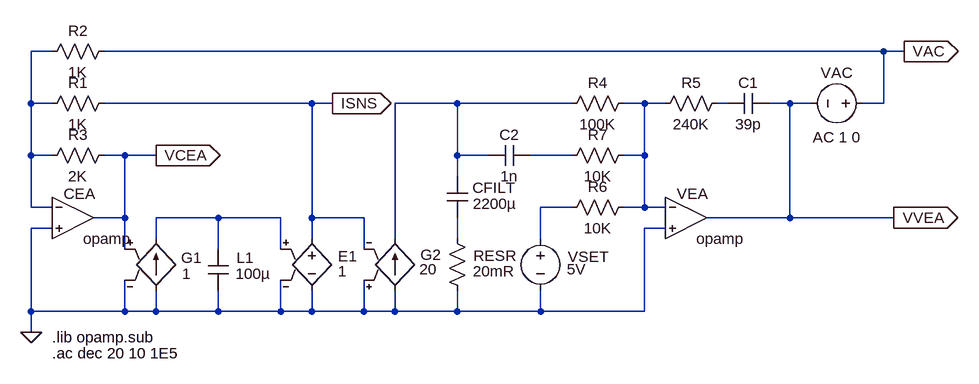
[diagram p0: schematic vimodlinc.asc]
vimodlinc.asc, the LTspice schematic file:
Version 4
SHEET 1 880 680
WIRE -816 128 -816 48
WIRE -816 208 -816 128
WIRE -816 288 -816 208
WIRE -816 448 -816 320
WIRE -816 480 -816 448
WIRE -784 48 -816 48
WIRE -784 128 -816 128
WIRE -784 208 -816 208
WIRE -784 288 -816 288
WIRE -784 320 -816 320
WIRE -672 208 -704 208
WIRE -672 304 -720 304
WIRE -672 304 -672 208
WIRE -672 352 -672 304
WIRE -672 448 -816 448
WIRE -672 448 -672 400
WIRE -624 208 -672 208
WIRE -624 336 -624 304
WIRE -624 448 -672 448
WIRE -624 448 -624 416
WIRE -528 304 -624 304
WIRE -528 352 -528 304
WIRE -528 448 -624 448
WIRE -528 448 -528 416
WIRE -432 304 -528 304
WIRE -432 352 -432 304
WIRE -432 448 -528 448
WIRE -432 448 -432 400
WIRE -384 128 -704 128
WIRE -384 304 -384 128
WIRE -384 336 -384 304
WIRE -384 448 -432 448
WIRE -384 448 -384 416
WIRE -352 128 -384 128
WIRE -304 304 -384 304
WIRE -304 352 -304 304
WIRE -304 448 -384 448
WIRE -304 448 -304 400
WIRE -256 336 -256 128
WIRE -256 448 -304 448
WIRE -256 448 -256 416
WIRE -160 128 -256 128
WIRE -160 208 -160 128
WIRE -160 240 -160 208
WIRE -160 336 -160 304
WIRE -160 448 -256 448
WIRE -160 448 -160 416
WIRE -112 208 -160 208
WIRE -32 336 -32 288
WIRE -32 448 -160 448
WIRE -32 448 -32 416
WIRE 16 128 -160 128
WIRE 16 208 -48 208
WIRE 16 288 -32 288
WIRE 128 128 96 128
WIRE 128 208 96 208
WIRE 128 208 128 128
WIRE 128 288 96 288
WIRE 128 288 128 208
WIRE 128 448 -32 448
WIRE 128 448 128 320
WIRE 160 128 128 128
WIRE 160 288 128 288
WIRE 160 320 128 320
WIRE 256 128 240 128
WIRE 352 128 320 128
WIRE 352 304 224 304
WIRE 352 304 352 128
WIRE 384 128 352 128
WIRE 496 48 -704 48
WIRE 496 128 464 128
WIRE 496 128 496 48
WIRE 512 304 352 304
WIRE 528 48 496 48
FLAG -816 480 0
FLAG -624 208 VCEA
IOPIN -624 208 Out
FLAG -352 128 ISNS
IOPIN -352 128 Out
FLAG 512 304 VVEA
IOPIN 512 304 Out
FLAG 528 48 VAC
IOPIN 528 48 Out
SYMBOL cap -176 240 R0
WINDOW 0 39 18 Left 0
WINDOW 3 40 42 Left 0
SYMATTR InstName CFILT
SYMATTR Value 2200µ
SYMBOL res -176 320 R0
WINDOW 0 41 42 Left 0
WINDOW 3 40 66 Left 0
SYMATTR InstName RESR
SYMATTR Value 20mR
SYMBOL cap -544 352 R0
WINDOW 0 44 13 Left 0
WINDOW 3 43 38 Left 0
SYMATTR InstName L1
SYMATTR Value 100µ
SYMBOL g -624 320 R0
WINDOW 0 39 45 Left 0
WINDOW 3 40 70 Left 0
SYMATTR InstName G1
SYMATTR Value 1
SYMBOL Opamps\\opamp -752 240 R0
WINDOW 0 -14 27 Left 0
SYMATTR InstName CEA
SYMATTR SpiceLine2 GBW=2Meg
SYMBOL res -688 112 R90
WINDOW 0 0 56 VBottom 0
WINDOW 3 32 56 VTop 0
SYMATTR InstName R1
SYMATTR Value 1K
SYMBOL res -688 32 R90
WINDOW 0 0 56 VBottom 0
WINDOW 3 32 56 VTop 0
SYMATTR InstName R2
SYMATTR Value 1K
SYMBOL res -800 224 R270
WINDOW 0 32 56 VTop 0
WINDOW 3 0 56 VBottom 0
SYMATTR InstName R3
SYMATTR Value 2K
SYMBOL e -384 320 R0
WINDOW 0 40 43 Left 0
WINDOW 3 40 66 Left 0
SYMATTR InstName E1
SYMATTR Value 1
SYMBOL g2 -256 320 R0
WINDOW 0 39 41 Left 0
WINDOW 3 38 63 Left 0
SYMATTR InstName G2
SYMATTR Value 20
SYMBOL Opamps\\opamp 192 240 R0
WINDOW 0 -14 27 Left 0
SYMATTR InstName VEA
SYMATTR SpiceLine2 GBW=5Meg
SYMBOL res 0 144 R270
WINDOW 0 32 56 VTop 0
WINDOW 3 0 56 VBottom 0
SYMATTR InstName R4
SYMATTR Value 100K
SYMBOL res 144 144 R270
WINDOW 0 32 56 VTop 0
WINDOW 3 0 56 VBottom 0
SYMATTR InstName R5
SYMATTR Value 240K
SYMBOL voltage 480 128 R90
WINDOW 0 -32 56 VBottom 0
WINDOW 3 32 56 VTop 0
WINDOW 123 36 56 VTop 0
WINDOW 39 0 0 Left 0
SYMATTR InstName VAC
SYMATTR Value ""
SYMATTR Value2 AC 1 0
SYMBOL voltage -32 320 R0
WINDOW 0 42 44 Left 0
WINDOW 3 41 63 Left 0
WINDOW 123 0 0 Left 0
WINDOW 39 0 0 Left 0
SYMATTR InstName VSET
SYMATTR Value 5V
SYMBOL res 112 272 R90
WINDOW 0 0 56 VBottom 0
WINDOW 3 32 56 VTop 0
SYMATTR InstName R6
SYMATTR Value 10K
SYMBOL cap 320 112 R90
WINDOW 0 0 32 VBottom 0
WINDOW 3 32 32 VTop 0
SYMATTR InstName C1
SYMATTR Value 39p
SYMBOL res 112 192 R90
WINDOW 0 0 56 VBottom 0
WINDOW 3 32 56 VTop 0
SYMATTR InstName R7
SYMATTR Value 10K
SYMBOL cap -48 192 R90
WINDOW 0 0 32 VBottom 0
WINDOW 3 32 32 VTop 0
SYMATTR InstName C2
SYMATTR Value 1n
TEXT -784 488 Left 0 !.lib opamp.sub
TEXT -784 512 Left 0 !.ac dec 20 10 1E5

The netlist it stands for:
* vimodlinc.asc
CFILT N003 N004 2200µ
RESR N004 0 20mR
C§L1 N002 0 100µ
G1 0 N002 VCEA 0 1
XCEA N001 0 VCEA opamp Aol=100K GBW=2Meg  ; pins invin noninvin out
R1 ISNS N001 1K
R2 VAC N001 1K
R3 N001 VCEA 2K
E1 ISNS 0 N002 0 1
G2 0 N003 0 ISNS 20
XVEA N007 0 VVEA opamp Aol=100K GBW=5Meg  ; pins invin noninvin out
R4 N003 N007 100K
R5 N007 N008 240K
VAC VAC VVEA AC 1 0
VSET N005 0 5V
R6 N007 N005 10K
C1 VVEA N008 39p
R7 N007 N006 10K
C2 N006 N003 1n
.lib opamp.sub
.ac dec 20 10 1E5
.backanno
.end